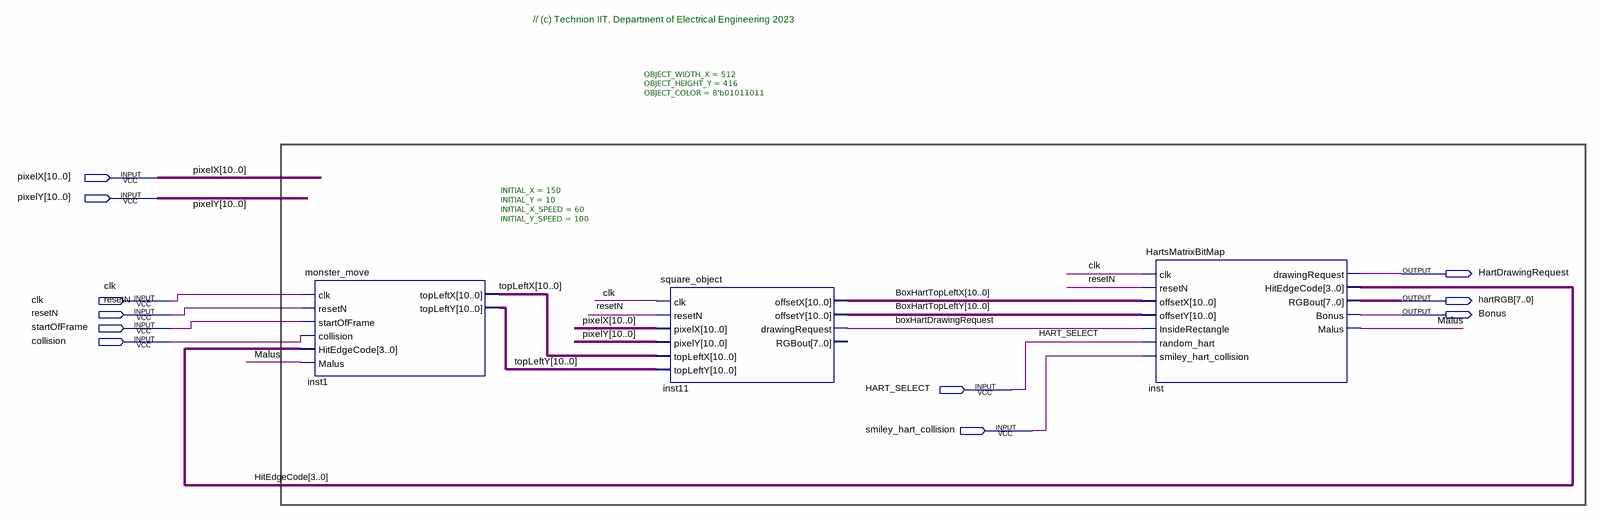
[diagram p0: schematic sheet]
// Quartus schematic HART_DISPLAY.bdf as structural Verilog: 3 symbols, 11 pins
module HART_DISPLAY (
  input  [10:0] pixelX,
  input  [10:0] pixelY,
  input  clk,
  input  resetN,
  input  startOfFrame,
  input  collision,
  input  HART_SELECT,
  input  smiley_hart_collision,
  output HartDrawingRequest,
  output [7:0] hartRGB,
  output Bonus
);

  wire boxHartDrawingRequest, Malus;
  wire [3:0] HitEdgeCode;
  wire [10:0] BoxHartTopLeftX, BoxHartTopLeftY, topLeftX, topLeftY;

  monster_move #(.INITIAL_X(150), .INITIAL_Y(10), .INITIAL_X_SPEED(60), .INITIAL_Y_SPEED(100)) inst1 (
    .clk(clk), .resetN(resetN), .startOfFrame(startOfFrame), .collision(collision),
    .HitEdgeCode(HitEdgeCode), .Malus(Malus), .topLeftX(topLeftX), .topLeftY(topLeftY));
  square_object #(.OBJECT_WIDTH_X(512), .OBJECT_HEIGHT_Y(416), .OBJECT_COLOR(8'b01011011)) inst11 (
    .clk(clk), .resetN(resetN), .pixelX(pixelX), .pixelY(pixelY), .topLeftX(topLeftX), .topLeftY(topLeftY),
    .offsetX(BoxHartTopLeftX), .offsetY(BoxHartTopLeftY), .drawingRequest(boxHartDrawingRequest));  // open: RGBout
  HartsMatrixBitMap inst (
    .clk(clk), .resetN(resetN), .offsetX(BoxHartTopLeftX), .offsetY(BoxHartTopLeftY),
    .InsideRectangle(boxHartDrawingRequest), .random_hart(HART_SELECT),
    .smiley_hart_collision(smiley_hart_collision), .drawingRequest(HartDrawingRequest),
    .HitEdgeCode(HitEdgeCode), .RGBout(hartRGB), .Bonus(Bonus), .Malus(Malus));

  // Notes on the sheet:
  //   // (c) Technion IIT, Department of Electrical Engineering 2023
endmodule
